# EAGLE schematic GDPHS_VGA - v2.2.1 (EAGLE 7.3.0)

## Sheet 1 of 4
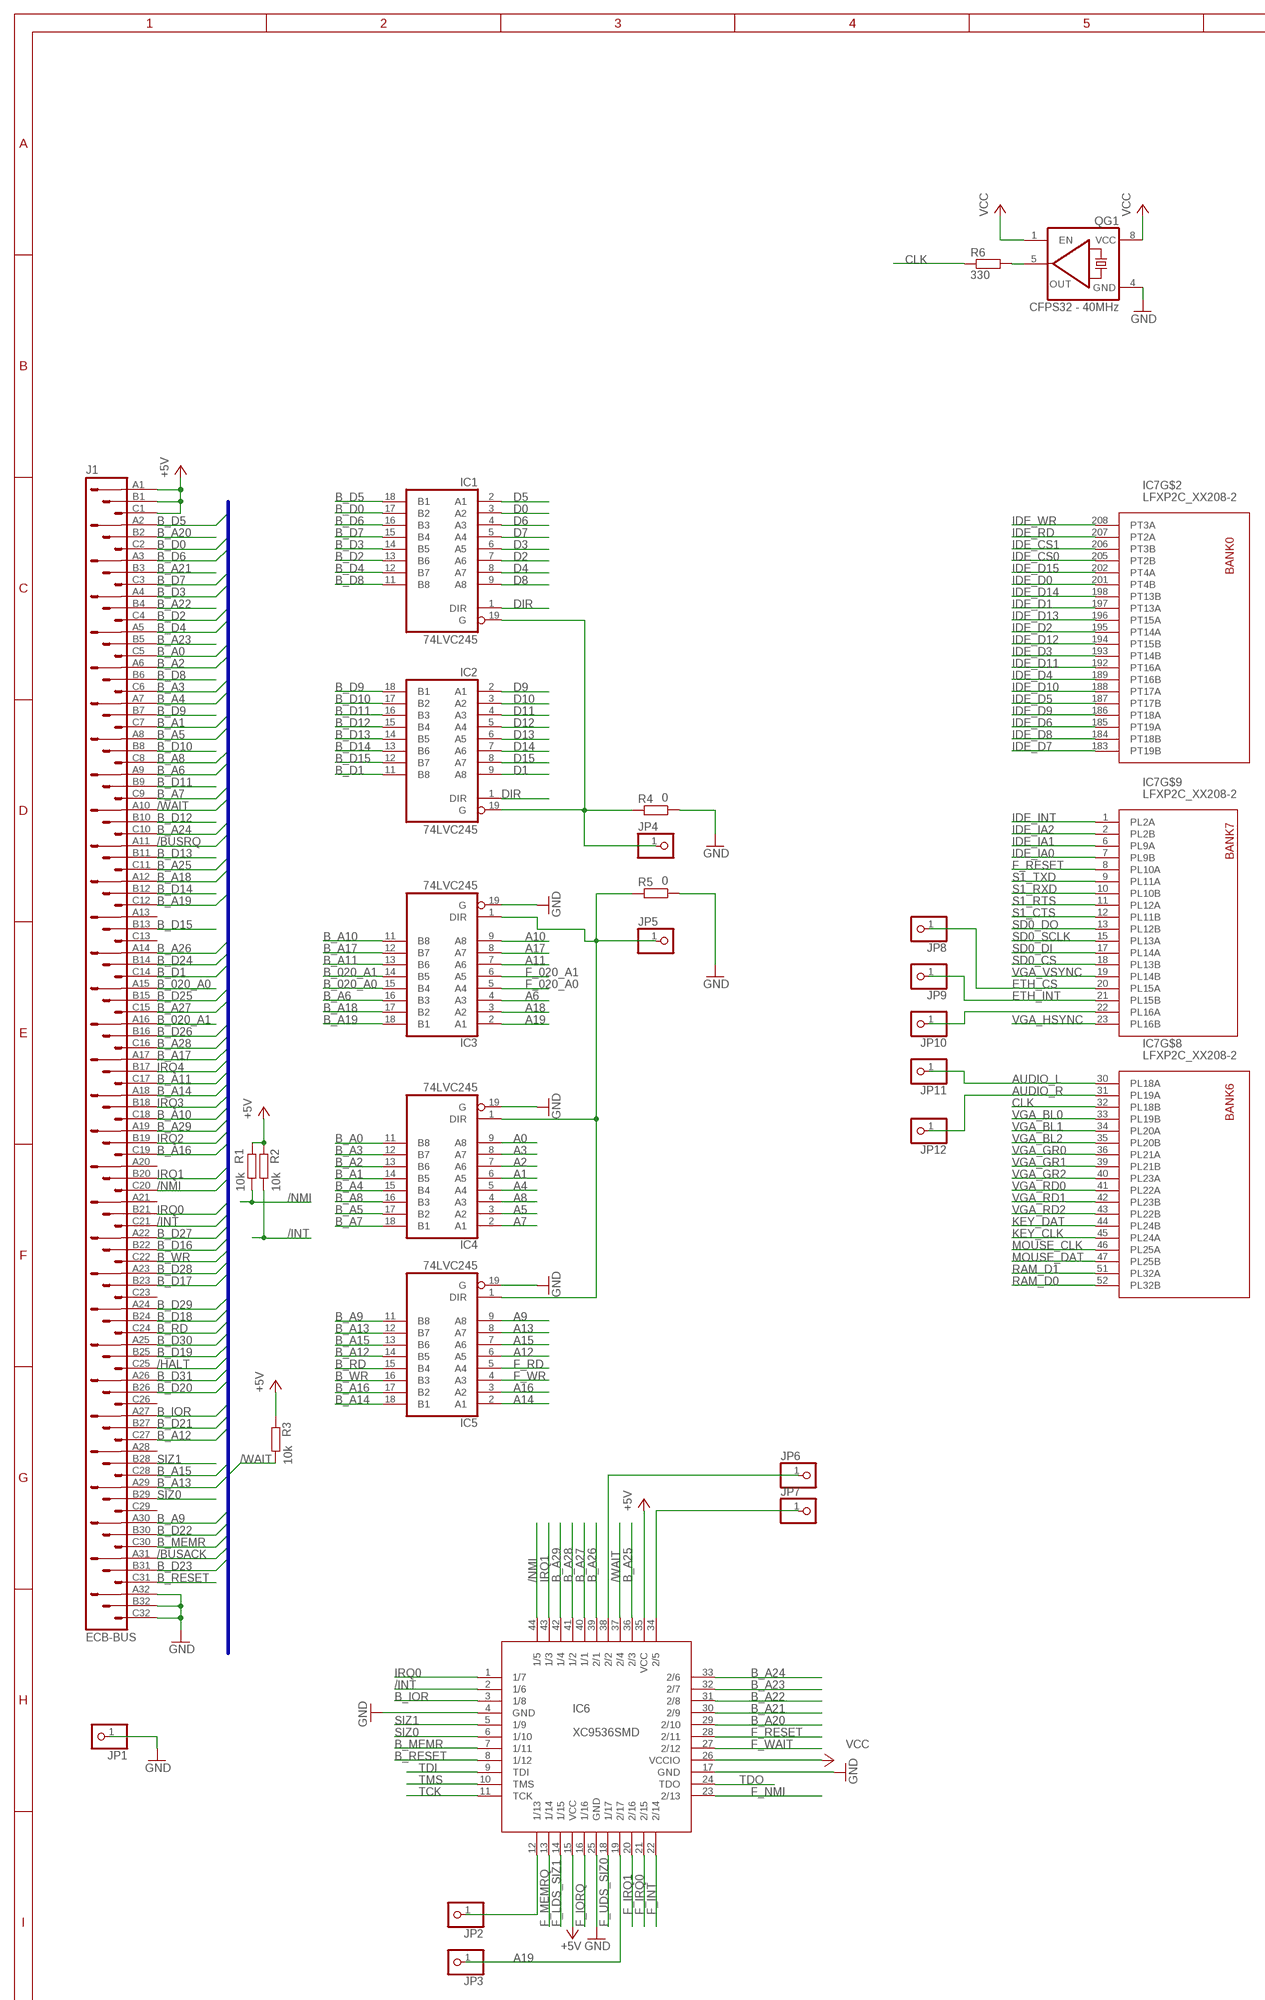
[diagram p0: schematic, sheet 1, part 1 of 2]
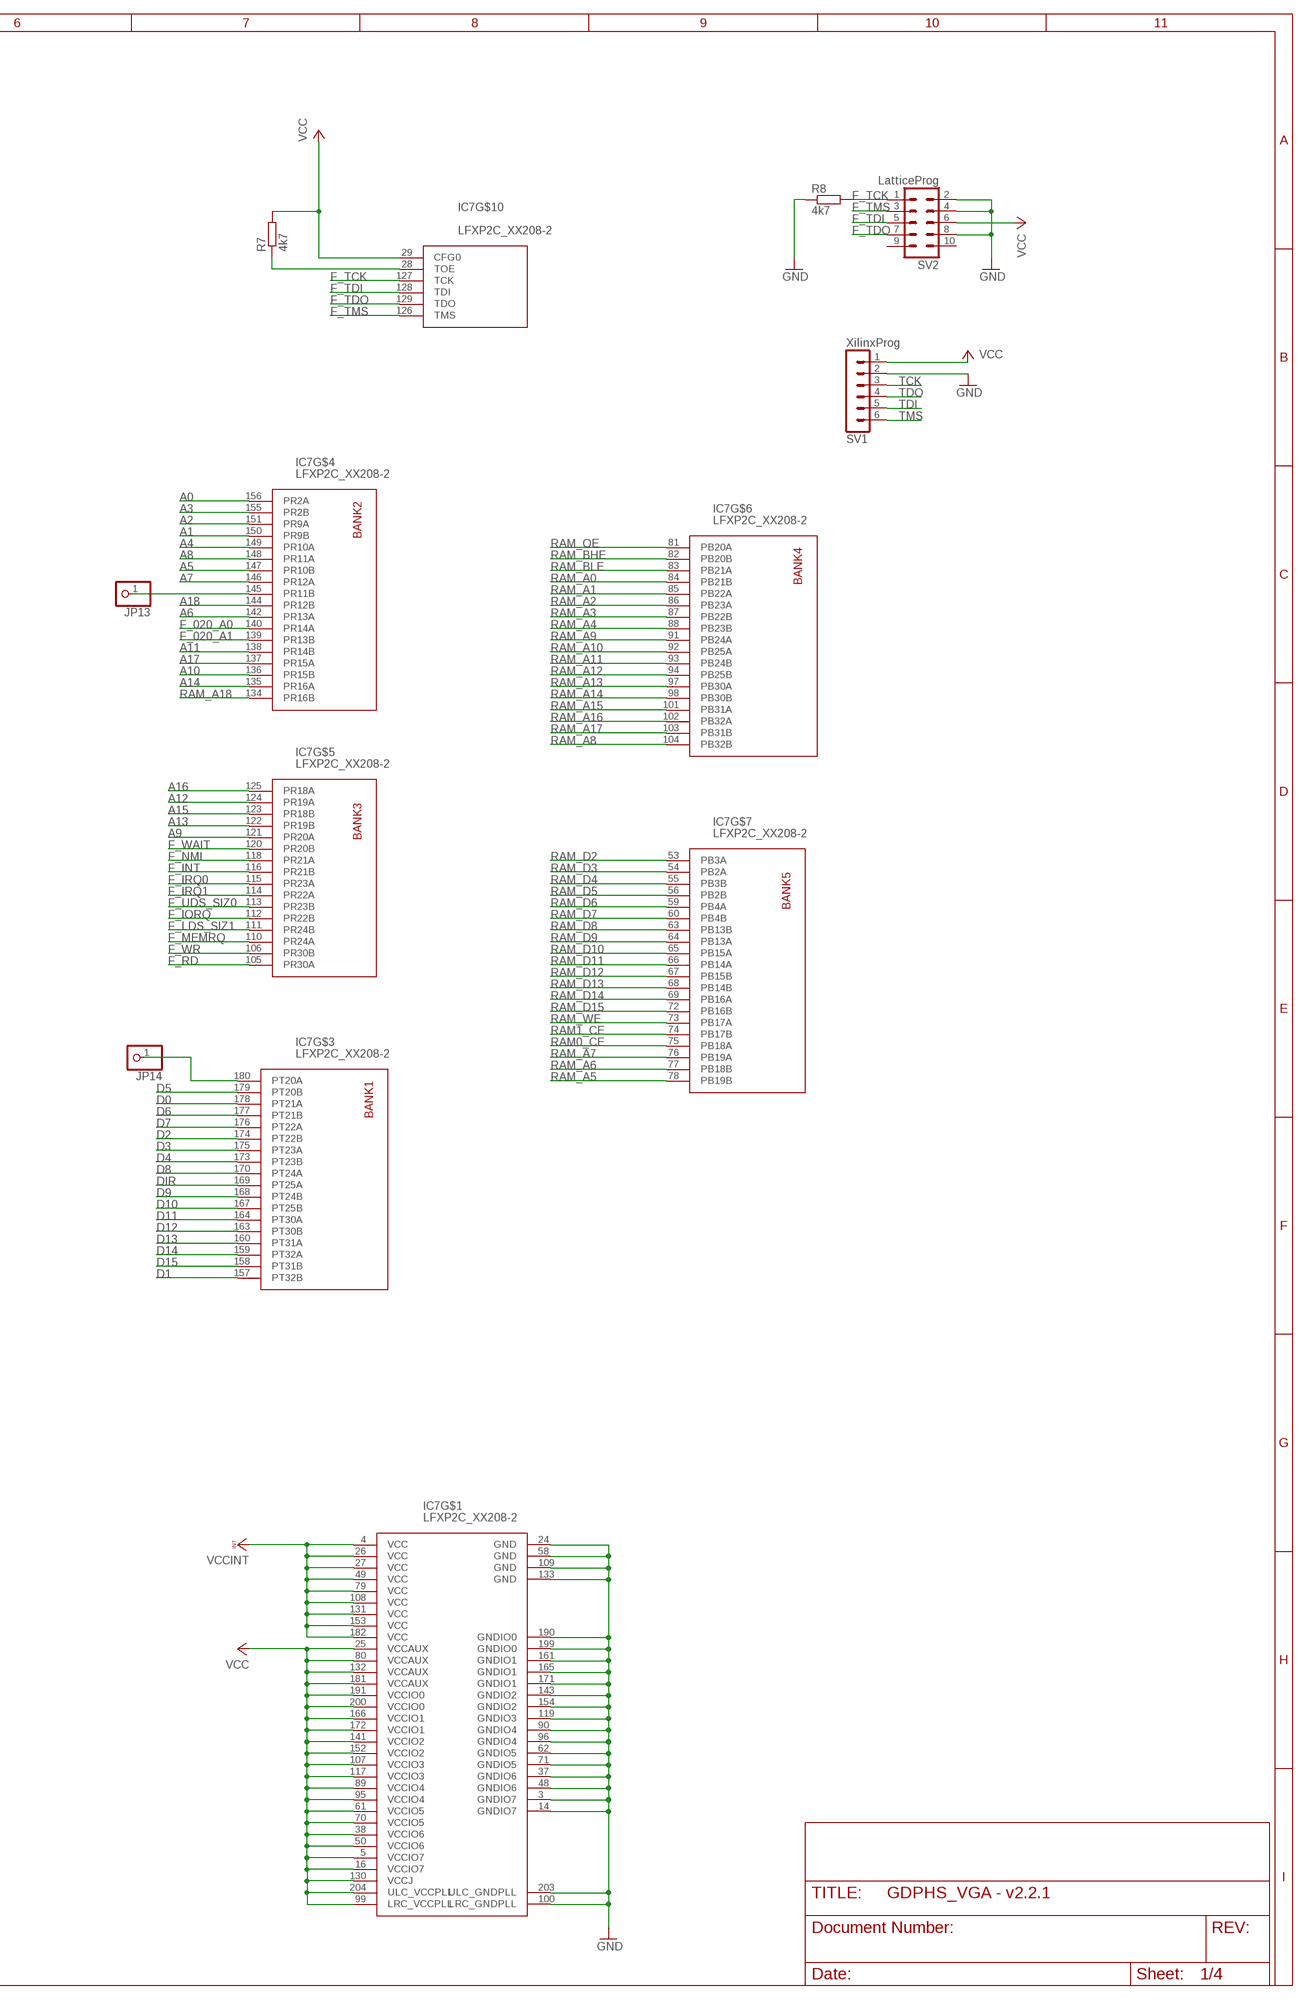
[diagram p1: schematic, sheet 1, part 2 of 2]

### Parts
IC1  74LVC245  74LVC245DW  [SO20W]
IC2  74LVC245  74LVC245DW  [SO20W]
IC3  74LVC245  74LVC245DW  [SO20W]
IC4  74LVC245  74LVC245DW  [SO20W]
IC5  74LVC245  74LVC245DW  [SO20W]
IC6  XC9536SMD  [TQFP44]
IC7  LFXP2C_XX208-2  [PQFP_208]
J1  ECB-BUS  VG96K  [VG96K]
JP1  PINHD-1X1  [1X01]
JP2  PINHD-1X1  [1X01]
JP3  PINHD-1X1  [1X01]
JP4  PINHD-1X1  [1X01]
JP5  PINHD-1X1  [1X01]
JP6  PINHD-1X1  [1X01]
JP7  PINHD-1X1  [1X01]
JP8  PINHD-1X1  [1X01]
JP9  PINHD-1X1  [1X01]
JP10  PINHD-1X1  [1X01]
JP11  PINHD-1X1  [1X01]
JP12  PINHD-1X1  [1X01]
JP13  PINHD-1X1  [1X01]
JP14  PINHD-1X1  [1X01]
QG1  CFPS32 - 40MHz  CRYSTAL_RESONATORCFPS7X  [CFPS7X]
R1  10k  R-EU_M0805  [M0805]
R2  10k  R-EU_M0805  [M0805]
R3  10k  R-EU_M0805  [M0805]
R4  0  R-EU_M0805  [M0805]
R5  0  R-EU_M0805  [M0805]
R6  330  R-EU_M0805  [M0805]
R7  4k7  R-EU_M0805  [M0805]
R8  4k7  R-EU_M0805  [M0805]
SV1  XilinxProg  MA06-1  [MA06-1]
SV2  LatticeProg  MA05-2  [MA05-2]

### Nets
$34: IC6.38(2/2) JP6.1
+5V: IC6.15(VCC) IC6.35(VCC) J1.A1 J1.B1 J1.C1 R1.2 R2.2 R3.2 ; also sheet 2,3
/BUSACK: J1.A31
/BUSRQ: J1.A11
/HALT: J1.C25
/INT: IC6.2(1/6) J1.C21 R2.1
/NMI: IC6.44(1/5) J1.C20 R1.1
/WAIT: IC6.37(2/4) J1.A10 R3.1
A0: IC4.9(A8) IC7.156(PR2A)
A1: IC4.6(A5) IC7.150(PR9B)
A2: IC4.7(A6) IC7.151(PR9A)
A3: IC4.8(A7) IC7.155(PR2B)
A4: IC4.5(A4) IC7.149(PR10A)
A5: IC4.3(A2) IC7.147(PR10B)
A6: IC3.4(A3) IC7.142(PR13A)
A7: IC4.2(A1) IC7.146(PR12A)
A8: IC4.4(A3) IC7.148(PR11A)
A9: IC5.9(A8) IC7.121(PR20A)
A10: IC3.9(A8) IC7.136(PR15B)
A11: IC3.7(A6) IC7.138(PR14B)
A12: IC5.6(A5) IC7.124(PR19A)
A13: IC5.8(A7) IC7.122(PR19B)
A14: IC5.2(A1) IC7.135(PR16A)
A15: IC5.7(A6) IC7.123(PR18B)
A16: IC5.3(A2) IC7.125(PR18A)
A17: IC3.8(A7) IC7.137(PR15A)
A18: IC3.3(A2) IC7.144(PR12B)
A19: IC3.2(A1) IC6.19(2/17) JP3.1
AUDIO_L: IC7.30(PL18A) JP11.1 ; also sheet 3
AUDIO_R: IC7.31(PL19A) JP12.1 ; also sheet 3
B_020_A0: IC3.15(B4) J1.A15
B_020_A1: IC3.14(B5) J1.A16
B_A0: IC4.11(B8) J1.C5
B_A1: IC4.14(B5) J1.C7
B_A2: IC4.13(B6) J1.A6
B_A3: IC4.12(B7) J1.C6
B_A4: IC4.15(B4) J1.A7
B_A5: IC4.17(B2) J1.A8
B_A6: IC3.16(B3) J1.A9
B_A7: IC4.18(B1) J1.C9
B_A8: IC4.16(B3) J1.C8
B_A9: IC5.11(B8) J1.A30
B_A10: IC3.11(B8) J1.C18
B_A11: IC3.13(B6) J1.C17
B_A12: IC5.14(B5) J1.C27
B_A13: IC5.12(B7) J1.A29
B_A14: IC5.18(B1) J1.A18
B_A15: IC5.13(B6) J1.C28
B_A16: IC5.17(B2) J1.C19
B_A17: IC3.12(B7) J1.A17
B_A18: IC3.17(B2) J1.A12
B_A19: IC3.18(B1) J1.C12
B_A20: IC6.29(2/10) J1.B2
B_A21: IC6.30(2/9) J1.B3
B_A22: IC6.31(2/8) J1.B4
B_A23: IC6.32(2/7) J1.B5
B_A24: IC6.33(2/6) J1.C10
B_A25: IC6.36(2/3) J1.C11
B_A26: IC6.39(2/1) J1.A14
B_A27: IC6.40(1/1) J1.C15
B_A28: IC6.41(1/2) J1.C16
B_A29: IC6.42(1/4) J1.A19
B_D0: IC1.17(B2) J1.C2
B_D1: IC2.11(B8) J1.C14
B_D2: IC1.13(B6) J1.C4
B_D3: IC1.14(B5) J1.A4
B_D4: IC1.12(B7) J1.A5
B_D5: IC1.18(B1) J1.A2
B_D6: IC1.16(B3) J1.A3
B_D7: IC1.15(B4) J1.C3
B_D8: IC1.11(B8) J1.B6
B_D9: IC2.18(B1) J1.B7
B_D10: IC2.17(B2) J1.B8
B_D11: IC2.16(B3) J1.B9
B_D12: IC2.15(B4) J1.B10
B_D13: IC2.14(B5) J1.B11
B_D14: IC2.13(B6) J1.B12
B_D15: IC2.12(B7) J1.B13
B_D16: J1.B22
B_D17: J1.B23
B_D18: J1.B24
B_D19: J1.B25
B_D20: J1.B26
B_D21: J1.B27
B_D22: J1.B30
B_D23: J1.B31
B_D24: J1.B14
B_D25: J1.B15
B_D26: J1.B16
B_D27: J1.A22
B_D28: J1.A23
B_D29: J1.A24
B_D30: J1.A25
B_D31: J1.A26
B_IOR: IC6.3(1/8) J1.A27
B_MEMR: IC6.7(1/11) J1.C30
B_RD: IC5.15(B4) J1.C24
B_RESET: IC6.8(1/12) J1.C31
B_WR: IC5.16(B3) J1.C22
CLK: IC7.32(PL18B) R6.1
D0: IC1.3(A2) IC7.178(PT21A)
D1: IC2.9(A8) IC7.157(PT32B)
D2: IC1.7(A6) IC7.174(PT22B)
D3: IC1.6(A5) IC7.175(PT23A)
D4: IC1.8(A7) IC7.173(PT23B)
D5: IC1.2(A1) IC7.179(PT20B)
D6: IC1.4(A3) IC7.177(PT21B)
D7: IC1.5(A4) IC7.176(PT22A)
D8: IC1.9(A8) IC7.170(PT24A)
D9: IC2.2(A1) IC7.168(PT24B)
D10: IC2.3(A2) IC7.167(PT25B)
D11: IC2.4(A3) IC7.164(PT30A)
D12: IC2.5(A4) IC7.163(PT30B)
D13: IC2.6(A5) IC7.160(PT31A)
D14: IC2.7(A6) IC7.159(PT32A)
D15: IC2.8(A7) IC7.158(PT31B)
DIR: IC1.1(DIR) IC2.1(DIR) IC7.169(PT25A)
ETH_CS: IC7.20(PL15A) JP8.1 ; also sheet 4
ETH_INT: IC7.21(PL15B) JP9.1 ; also sheet 4
F_020_A0: IC3.5(A4) IC7.140(PR14A)
F_020_A1: IC3.6(A5) IC7.139(PR13B)
F_INT: IC6.22(2/14) IC7.116(PR21B)
F_IORQ: IC6.16(1/16) IC7.112(PR22B)
F_IRQ0: IC6.21(2/15) IC7.115(PR23A)
F_IRQ1: IC6.20(2/16) IC7.114(PR22A)
F_LDS_SIZ1: IC6.14(1/15) IC7.111(PR24B)
F_MEMRQ: IC6.13(1/14) IC7.110(PR24A)
F_NMI: IC6.23(2/13) IC7.118(PR21A)
F_RD: IC5.5(A4) IC7.105(PR30A)
F_RESET: IC6.28(2/11) IC7.8(PL10A) ; also sheet 3,4
F_TCK: IC7.127(TCK) R8.2 SV2.1
F_TDI: IC7.128(TDI) SV2.5
F_TDO: IC7.129(TDO) SV2.7
F_TMS: IC7.126(TMS) SV2.3
F_UDS_SIZ0: IC6.18(1/17) IC7.113(PR23B)
F_WAIT: IC6.27(2/12) IC7.120(PR20B)
F_WR: IC5.4(A3) IC7.106(PR30B)
GND: IC3.19(G) IC4.19(G) IC5.19(G) IC6.4(GND) IC6.17(GND) IC6.25(GND) IC7.3(GNDIO7) IC7.14(GNDIO7) IC7.24(GND) IC7.37(GNDIO6) IC7.48(GNDIO6) IC7.58(GND) IC7.62(GNDIO5) IC7.71(GNDIO5) IC7.90(GNDIO4) IC7.96(GNDIO4) IC7.100(LRC_GNDPLL) IC7.109(GND) IC7.119(GNDIO3) IC7.133(GND) IC7.143(GNDIO2) IC7.154(GNDIO2) IC7.161(GNDIO1) IC7.165(GNDIO1) IC7.171(GNDIO1) IC7.190(GNDIO0) IC7.199(GNDIO0) IC7.203(ULC_GNDPLL) J1.A32 J1.B32 J1.C32 JP1.1 QG1.4(GND) R4.1 R5.1 R8.1 SV1.2 SV2.2 SV2.4 SV2.8 ; also sheet 2,3,4
IDE_CS0: IC7.205(PT2B) ; also sheet 3
IDE_CS1: IC7.206(PT3B) ; also sheet 3
IDE_D0: IC7.201(PT4B) ; also sheet 3
IDE_D1: IC7.197(PT13A) ; also sheet 3
IDE_D2: IC7.195(PT14A) ; also sheet 3
IDE_D3: IC7.193(PT14B) ; also sheet 3
IDE_D4: IC7.189(PT16B) ; also sheet 3
IDE_D5: IC7.187(PT17B) ; also sheet 3
IDE_D6: IC7.185(PT19A) ; also sheet 3
IDE_D7: IC7.183(PT19B) ; also sheet 3
IDE_D8: IC7.184(PT18B) ; also sheet 3
IDE_D9: IC7.186(PT18A) ; also sheet 3
IDE_D10: IC7.188(PT17A) ; also sheet 3
IDE_D11: IC7.192(PT16A) ; also sheet 3
IDE_D12: IC7.194(PT15B) ; also sheet 3
IDE_D13: IC7.196(PT15A) ; also sheet 3
IDE_D14: IC7.198(PT13B) ; also sheet 3
IDE_D15: IC7.202(PT4A) ; also sheet 3
IDE_IA0: IC7.7(PL9B) ; also sheet 3
IDE_IA1: IC7.6(PL9A) ; also sheet 3
IDE_IA2: IC7.2(PL2B) ; also sheet 3
IDE_INT: IC7.1(PL2A) ; also sheet 3
IDE_RD: IC7.207(PT2A) ; also sheet 3
IDE_WR: IC7.208(PT3A) ; also sheet 3
IRQ0: IC6.1(1/7) J1.B21
IRQ1: IC6.43(1/3) J1.B20
IRQ2: J1.B19
IRQ3: J1.B18
IRQ4: J1.B17
KEY_CLK: IC7.45(PL24A) ; also sheet 3
KEY_DAT: IC7.44(PL24B) ; also sheet 3
MOUSE_CLK: IC7.46(PL25A) ; also sheet 3
MOUSE_DAT: IC7.47(PL25B) ; also sheet 3
N$5: QG1.5(OUT) R6.2
N$25: IC7.22(PL16A) JP10.1
N$26: IC7.28(TOE) R7.1
N$31: IC7.145(PR11B) JP13.1
N$32: IC6.34(2/5) JP7.1
N$33: IC6.12(1/13) JP2.1
N$41: IC3.1(DIR) IC4.1(DIR) IC5.1(DIR) JP5.1 R5.2
N$42: IC1.19(G) IC2.19(G) JP4.1 R4.2
N$49: IC7.180(PT20A) JP14.1
RAM0_CE: IC7.75(PB18A) ; also sheet 2
RAM1_CE: IC7.74(PB17B) ; also sheet 2
RAM_A0: IC7.84(PB21B) ; also sheet 2
RAM_A1: IC7.85(PB22A) ; also sheet 2
RAM_A2: IC7.86(PB23A) ; also sheet 2
RAM_A3: IC7.87(PB22B) ; also sheet 2
RAM_A4: IC7.88(PB23B) ; also sheet 2
RAM_A5: IC7.78(PB19B) ; also sheet 2
RAM_A6: IC7.77(PB18B) ; also sheet 2
RAM_A7: IC7.76(PB19A) ; also sheet 2
RAM_A8: IC7.104(PB32B) ; also sheet 2
RAM_A9: IC7.91(PB24A) ; also sheet 2
RAM_A10: IC7.92(PB25A) ; also sheet 2
RAM_A11: IC7.93(PB24B) ; also sheet 2
RAM_A12: IC7.94(PB25B) ; also sheet 2
RAM_A13: IC7.97(PB30A) ; also sheet 2
RAM_A14: IC7.98(PB30B) ; also sheet 2
RAM_A15: IC7.101(PB31A) ; also sheet 2
RAM_A16: IC7.102(PB32A) ; also sheet 2
RAM_A17: IC7.103(PB31B) ; also sheet 2
RAM_A18: IC7.134(PR16B) ; also sheet 2
RAM_BHE: IC7.82(PB20B) ; also sheet 2
RAM_BLE: IC7.83(PB21A) ; also sheet 2
RAM_D0: IC7.52(PL32B) ; also sheet 2
RAM_D1: IC7.51(PL32A) ; also sheet 2
RAM_D2: IC7.53(PB3A) ; also sheet 2
RAM_D3: IC7.54(PB2A) ; also sheet 2
RAM_D4: IC7.55(PB3B) ; also sheet 2
RAM_D5: IC7.56(PB2B) ; also sheet 2
RAM_D6: IC7.59(PB4A) ; also sheet 2
RAM_D7: IC7.60(PB4B) ; also sheet 2
RAM_D8: IC7.63(PB13B) ; also sheet 2
RAM_D9: IC7.64(PB13A) ; also sheet 2
RAM_D10: IC7.65(PB15A) ; also sheet 2
RAM_D11: IC7.66(PB14A) ; also sheet 2
RAM_D12: IC7.67(PB15B) ; also sheet 2
RAM_D13: IC7.68(PB14B) ; also sheet 2
RAM_D14: IC7.69(PB16A) ; also sheet 2
RAM_D15: IC7.72(PB16B) ; also sheet 2
RAM_OE: IC7.81(PB20A) ; also sheet 2
RAM_WE: IC7.73(PB17A) ; also sheet 2
S1_CTS: IC7.12(PL11B) ; also sheet 3
S1_RTS: IC7.11(PL12A) ; also sheet 3
S1_RXD: IC7.10(PL10B) ; also sheet 3
S1_TXD: IC7.9(PL11A) ; also sheet 3
SD0_CS: IC7.18(PL13B) ; also sheet 3
SD0_DI: IC7.17(PL14A) ; also sheet 3,4
SD0_DO: IC7.13(PL12B) ; also sheet 3,4
SD0_SCLK: IC7.15(PL13A) ; also sheet 3,4
SIZ0: IC6.6(1/10) J1.B29
SIZ1: IC6.5(1/9) J1.B28
TCK: IC6.11(TCK) SV1.3
TDI: IC6.9(TDI) SV1.5
TDO: IC6.24(TDO) SV1.4
TMS: IC6.10(TMS) SV1.6
VCC: IC6.26(VCCIO) IC7.5(VCCIO7) IC7.16(VCCIO7) IC7.25(VCCAUX) IC7.29(CFG0) IC7.38(VCCIO6) IC7.50(VCCIO6) IC7.61(VCCIO5) IC7.70(VCCIO5) IC7.80(VCCAUX) IC7.89(VCCIO4) IC7.95(VCCIO4) IC7.99(LRC_VCCPLL) IC7.107(VCCIO3) IC7.117(VCCIO3) IC7.130(VCCJ) IC7.132(VCCAUX) IC7.141(VCCIO2) IC7.152(VCCIO2) IC7.166(VCCIO1) IC7.172(VCCIO1) IC7.181(VCCAUX) IC7.191(VCCIO0) IC7.200(VCCIO0) IC7.204(ULC_VCCPLL) QG1.1(EN) QG1.8(VCC) R7.2 SV1.1 SV2.6 ; also sheet 2,3,4
VCCINT: IC7.4(VCC) IC7.26(VCC) IC7.27(VCC) IC7.49(VCC) IC7.79(VCC) IC7.108(VCC) IC7.131(VCC) IC7.153(VCC) IC7.182(VCC) ; also sheet 2
VGA_BL0: IC7.33(PL19B) ; also sheet 3
VGA_BL1: IC7.34(PL20A) ; also sheet 3
VGA_BL2: IC7.35(PL20B) ; also sheet 3
VGA_GR0: IC7.36(PL21A) ; also sheet 3
VGA_GR1: IC7.39(PL21B) ; also sheet 3
VGA_GR2: IC7.40(PL23A) ; also sheet 3
VGA_HSYNC: IC7.23(PL16B) ; also sheet 3
VGA_RD0: IC7.41(PL22A) ; also sheet 3
VGA_RD1: IC7.42(PL23B) ; also sheet 3
VGA_RD2: IC7.43(PL22B) ; also sheet 3
VGA_VSYNC: IC7.19(PL14B) ; also sheet 3
Unconnected: J1.A13 J1.A20 J1.A21 J1.A28 J1.C13 J1.C23 J1.C26 J1.C29 SV2.9 SV2.10

### Buses
B_D[0..31],B_A[0..31],IRQ[0..7],B_BANK,B_HALT,B_RD,B_WR,B_IOR,B_MEMR,B_M1,B_RFSH,B_BACK,/INT,/NMI,/RESET,/WAIT,/BUSRQ,CLK,/BUSACK,/HALT

## Sheet 2 of 4
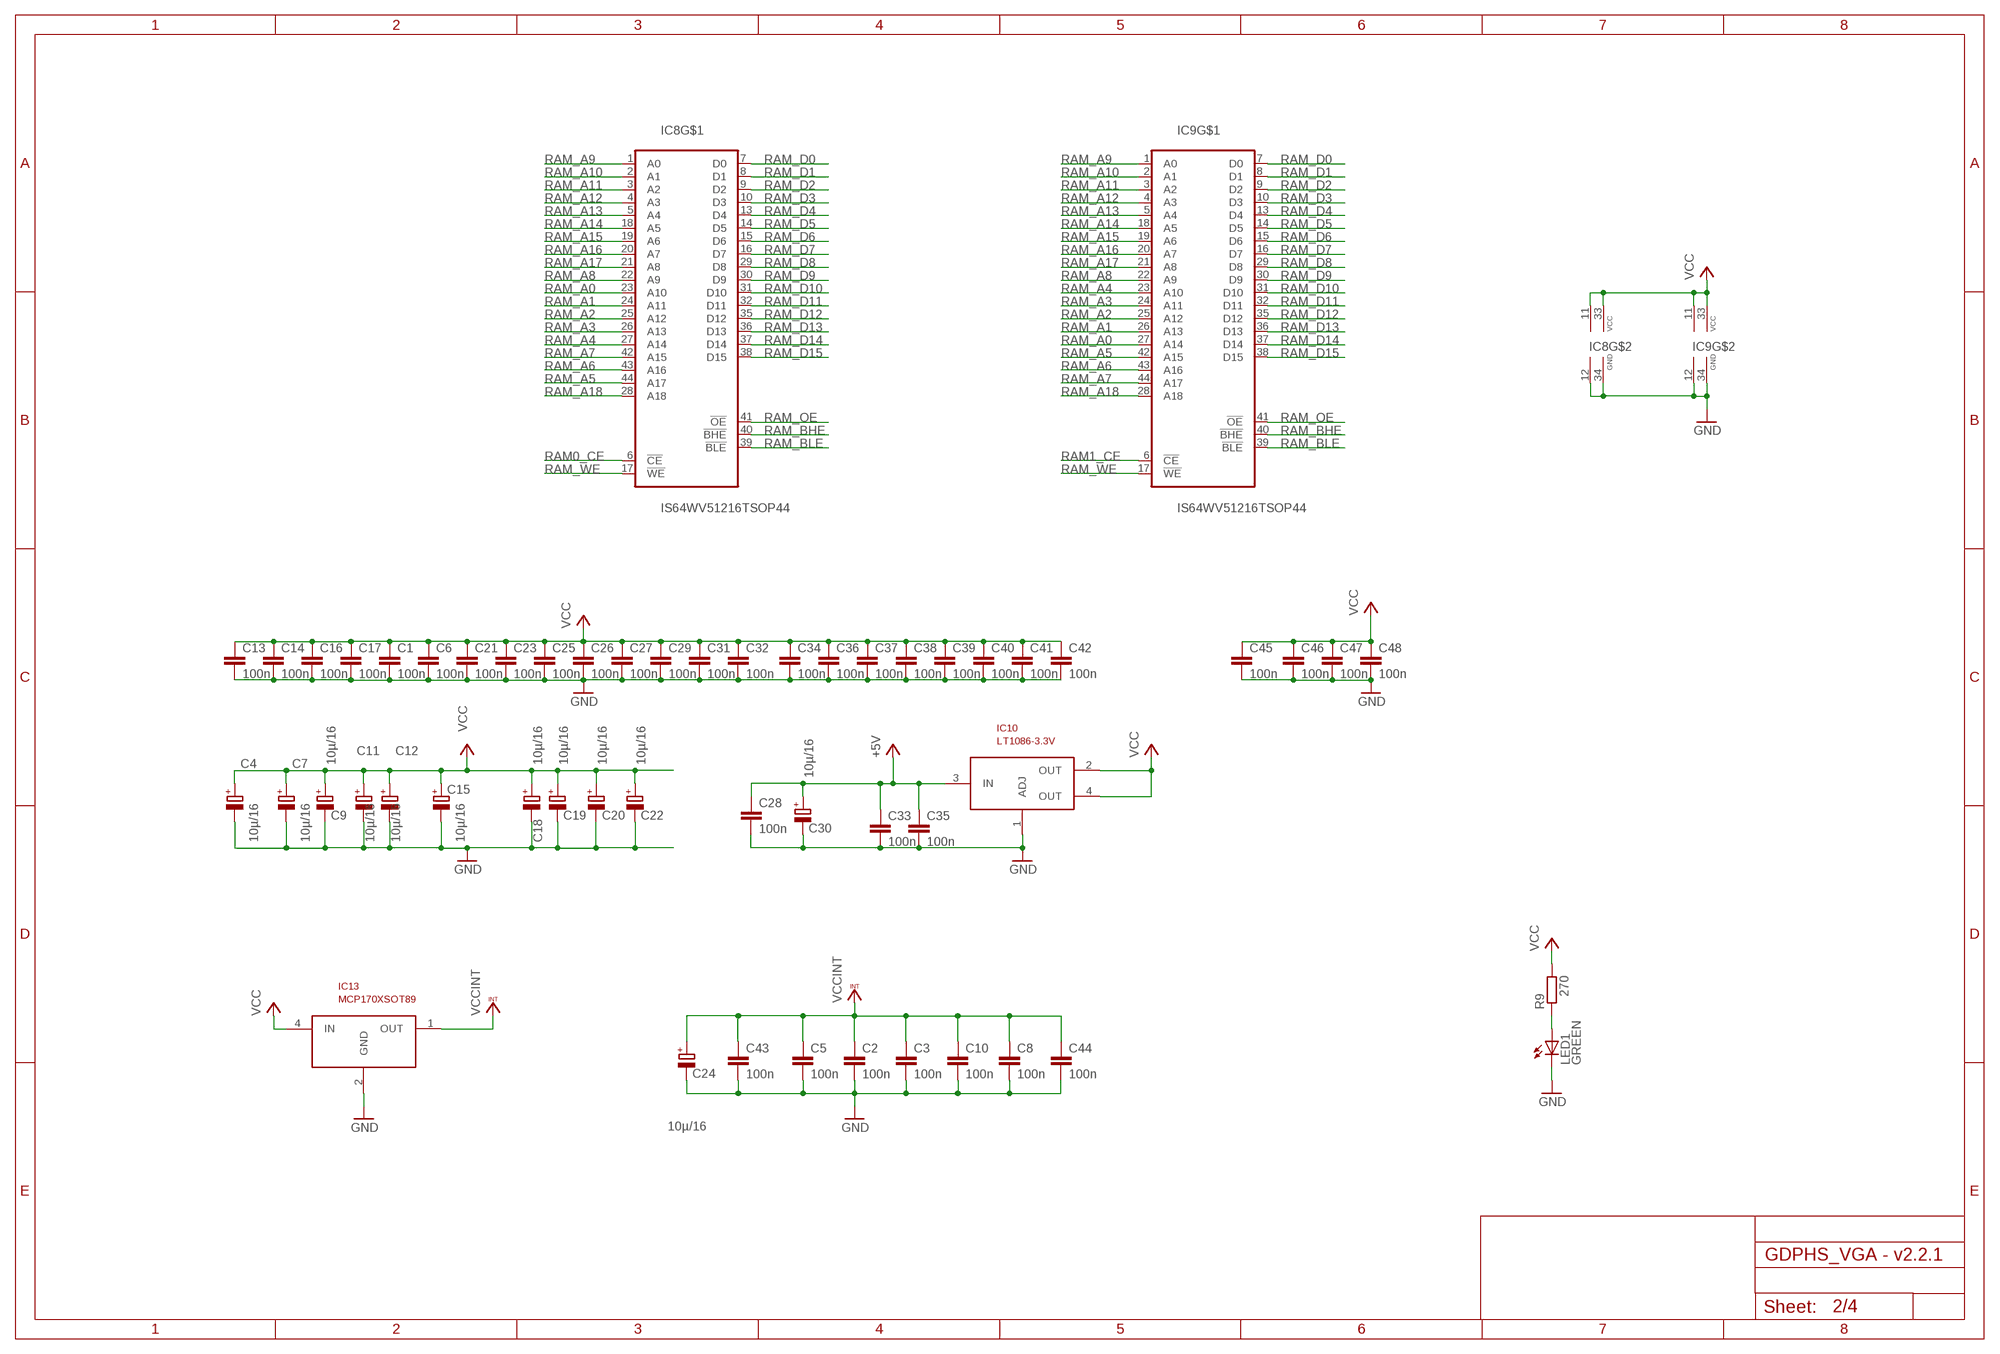
[diagram p2: schematic, sheet 2]

### Parts
C1  100n  C-EUC0805  [C0805]
C2  100n  C-EUC0805  [C0805]
C3  100n  C-EUC0805  [C0805]
C4  10µ/16  CPOL-EUSMCC  [SMC_C]
C5  100n  C-EUC0805  [C0805]
C6  100n  C-EUC0805  [C0805]
C7  10µ/16  CPOL-EUSMCC  [SMC_C]
C8  100n  C-EUC0805  [C0805]
C9  10µ/16  CPOL-EUSMCC  [SMC_C]
C10  100n  C-EUC0805  [C0805]
C11  10µ/16  CPOL-EUSMCC  [SMC_C]
C12  10µ/16  CPOL-EUSMCC  [SMC_C]
C13  100n  C-EUC0805  [C0805]
C14  100n  C-EUC0805  [C0805]
C15  10µ/16  CPOL-EUSMCC  [SMC_C]
C16  100n  C-EUC0805  [C0805]
C17  100n  C-EUC0805  [C0805]
C18  10µ/16  CPOL-EUSMCC  [SMC_C]
C19  10µ/16  CPOL-EUSMCC  [SMC_C]
C20  10µ/16  CPOL-EUSMCC  [SMC_C]
C21  100n  C-EUC0805  [C0805]
C22  10µ/16  CPOL-EUSMCC  [SMC_C]
C23  100n  C-EUC0805  [C0805]
C24  10µ/16  CPOL-EUSMCC  [SMC_C]
C25  100n  C-EUC0805  [C0805]
C26  100n  C-EUC0805  [C0805]
C27  100n  C-EUC0805  [C0805]
C28  100n  C-EUC0805  [C0805]
C29  100n  C-EUC0805  [C0805]
C30  10µ/16  CPOL-EUSMCC  [SMC_C]
C31  100n  C-EUC0805  [C0805]
C32  100n  C-EUC0805  [C0805]
C33  100n  C-EUC0805  [C0805]
C34  100n  C-EUC0805  [C0805]
C35  100n  C-EUC0805  [C0805]
C36  100n  C-EUC0805  [C0805]
C37  100n  C-EUC0805  [C0805]
C38  100n  C-EUC0805  [C0805]
C39  100n  C-EUC0805  [C0805]
C40  100n  C-EUC0805  [C0805]
C41  100n  C-EUC0805  [C0805]
C42  100n  C-EUC0805  [C0805]
C43  100n  C-EUC0805  [C0805]
C44  100n  C-EUC0805  [C0805]
C45  100n  C-EUC0805  [C0805]
C46  100n  C-EUC0805  [C0805]
C47  100n  C-EUC0805  [C0805]
C48  100n  C-EUC0805  [C0805]
IC8  IS64WV51216TSOP44  [TSOP44-400]
IC9  IS64WV51216TSOP44  [TSOP44-400]
IC10  LT1086-3.3V  LT1086  [MDD]
IC13  MCP170XSOT89  [SOT89-W]
LED1  GREEN  LEDCHIPLED_0805  [CHIPLED_0805]
R9  270  R-EU_M0805  [M0805]

### Nets
+5V: C28.1 C30.+ C33.1 C35.1 IC10.3(IN) ; also sheet 1,3
GND: C1.2 C2.2 C3.2 C4.- C5.2 C6.2 C7.- C8.2 C9.- C10.2 C11.- C12.- C13.2 C14.2 C15.- C16.2 C17.2 C18.- C19.- C20.- C21.2 C22.- C23.2 C24.- C25.2 C26.2 C27.2 C28.2 C29.2 C30.- C31.2 C32.2 C33.2 C34.2 C35.2 C36.2 C37.2 C38.2 C39.2 C40.2 C41.2 C42.2 C43.2 C44.2 C45.2 C46.2 C47.2 C48.2 IC8.12(GND) IC8.34(GND) IC9.12(GND) IC9.34(GND) IC10.1(ADJ) IC13.2(GND) LED1.C ; also sheet 1,3,4
N$15: LED1.A R9.1
RAM0_CE: IC8.6(!CE) ; also sheet 1
RAM1_CE: IC9.6(!CE) ; also sheet 1
RAM_A0: IC8.23(A10) IC9.27(A14) ; also sheet 1
RAM_A1: IC8.24(A11) IC9.26(A13) ; also sheet 1
RAM_A2: IC8.25(A12) IC9.25(A12) ; also sheet 1
RAM_A3: IC8.26(A13) IC9.24(A11) ; also sheet 1
RAM_A4: IC8.27(A14) IC9.23(A10) ; also sheet 1
RAM_A5: IC8.44(A17) IC9.42(A15) ; also sheet 1
RAM_A6: IC8.43(A16) IC9.43(A16) ; also sheet 1
RAM_A7: IC8.42(A15) IC9.44(A17) ; also sheet 1
RAM_A8: IC8.22(A9) IC9.22(A9) ; also sheet 1
RAM_A9: IC8.1(A0) IC9.1(A0) ; also sheet 1
RAM_A10: IC8.2(A1) IC9.2(A1) ; also sheet 1
RAM_A11: IC8.3(A2) IC9.3(A2) ; also sheet 1
RAM_A12: IC8.4(A3) IC9.4(A3) ; also sheet 1
RAM_A13: IC8.5(A4) IC9.5(A4) ; also sheet 1
RAM_A14: IC8.18(A5) IC9.18(A5) ; also sheet 1
RAM_A15: IC8.19(A6) IC9.19(A6) ; also sheet 1
RAM_A16: IC8.20(A7) IC9.20(A7) ; also sheet 1
RAM_A17: IC8.21(A8) IC9.21(A8) ; also sheet 1
RAM_A18: IC8.28(A18) IC9.28(A18) ; also sheet 1
RAM_BHE: IC8.40(!BHE) IC9.40(!BHE) ; also sheet 1
RAM_BLE: IC8.39(!BLE) IC9.39(!BLE) ; also sheet 1
RAM_D0: IC8.7(D0) IC9.7(D0) ; also sheet 1
RAM_D1: IC8.8(D1) IC9.8(D1) ; also sheet 1
RAM_D2: IC8.9(D2) IC9.9(D2) ; also sheet 1
RAM_D3: IC8.10(D3) IC9.10(D3) ; also sheet 1
RAM_D4: IC8.13(D4) IC9.13(D4) ; also sheet 1
RAM_D5: IC8.14(D5) IC9.14(D5) ; also sheet 1
RAM_D6: IC8.15(D6) IC9.15(D6) ; also sheet 1
RAM_D7: IC8.16(D7) IC9.16(D7) ; also sheet 1
RAM_D8: IC8.29(D8) IC9.29(D8) ; also sheet 1
RAM_D9: IC8.30(D9) IC9.30(D9) ; also sheet 1
RAM_D10: IC8.31(D10) IC9.31(D10) ; also sheet 1
RAM_D11: IC8.32(D11) IC9.32(D11) ; also sheet 1
RAM_D12: IC8.35(D12) IC9.35(D12) ; also sheet 1
RAM_D13: IC8.36(D13) IC9.36(D13) ; also sheet 1
RAM_D14: IC8.37(D14) IC9.37(D14) ; also sheet 1
RAM_D15: IC8.38(D15) IC9.38(D15) ; also sheet 1
RAM_OE: IC8.41(!OE) IC9.41(!OE) ; also sheet 1
RAM_WE: IC8.17(!WE) IC9.17(!WE) ; also sheet 1
VCC: C1.1 C4.+ C6.1 C7.+ C9.+ C11.+ C12.+ C13.1 C14.1 C15.+ C16.1 C17.1 C18.+ C19.+ C20.+ C21.1 C22.+ C23.1 C25.1 C26.1 C27.1 C29.1 C31.1 C32.1 C34.1 C36.1 C37.1 C38.1 C39.1 C40.1 C41.1 C42.1 C45.1 C46.1 C47.1 C48.1 IC8.11(VCC) IC8.33(VCC2) IC9.11(VCC) IC9.33(VCC2) IC10.2(OUT) IC10.4(OUT) IC13.4(IN) R9.2 ; also sheet 1,3,4
VCCINT: C2.1 C3.1 C5.1 C8.1 C10.1 C24.+ C43.1 C44.1 IC13.1(OUT) ; also sheet 1

## Sheet 3 of 4
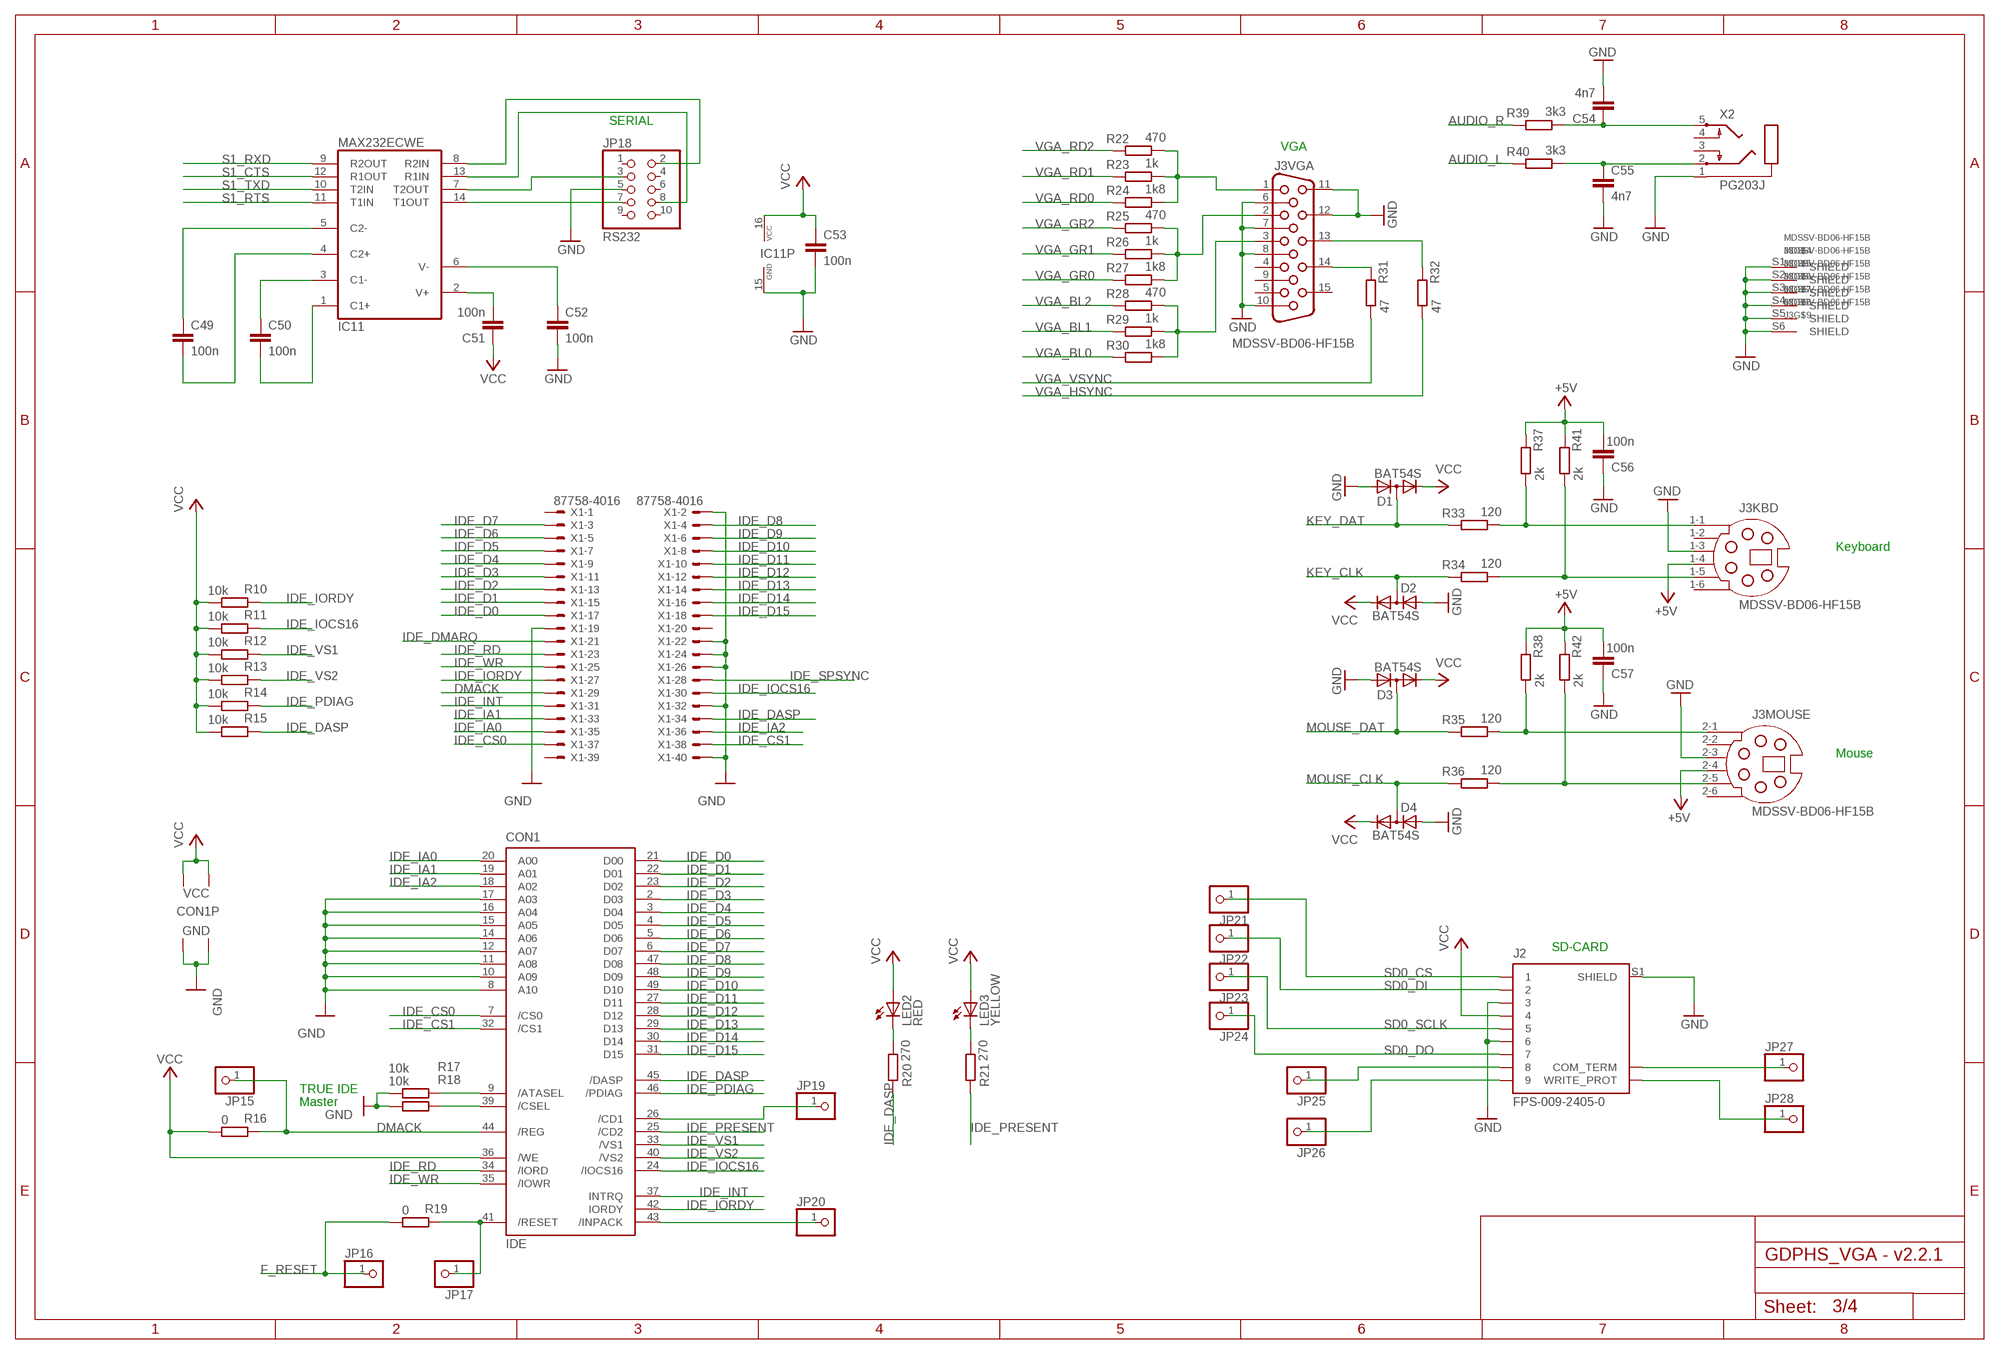
[diagram p3: schematic, sheet 3]

### Parts
C49  100n  C-EUC0805  [C0805]
C50  100n  C-EUC0805  [C0805]
C51  100n  C-EUC0805  [C0805]
C52  100n  C-EUC0805  [C0805]
C53  100n  C-EUC0805  [C0805]
C54  4n7  C-EUC0805  [C0805]
C55  4n7  C-EUC0805  [C0805]
C56  100n  C-EUC0805  [C0805]
C57  100n  C-EUC0805  [C0805]
CON1  IDE  CF-CARD-IDE_MODEYAMAI-CF-CARD-I-II  [CF-050-P2-X03-10-DS-1]
D1  BAT54S  DIODE_2CACA-SOT23  [SOT23]
D2  BAT54S  DIODE_2CACA-SOT23  [SOT23]
D3  BAT54S  DIODE_2CACA-SOT23  [SOT23]
D4  BAT54S  DIODE_2CACA-SOT23  [SOT23]
IC11  MAX232ECWE  [SO16L]
J2  FPS-009-2405-0  [FPS-009-2405-0]
J3  MDSSV-BD06-HF15B  [MDSSV-BD06-HF15-B]
JP15  PINHD-1X1  [1X01]
JP16  PINHD-1X1  [1X01]
JP17  PINHD-1X1  [1X01]
JP18  RS232  PINHD-2X5  [2X05]
JP19  PINHD-1X1  [1X01]
JP20  PINHD-1X1  [1X01]
JP21  PINHD-1X1  [1X01]
JP22  PINHD-1X1  [1X01]
JP23  PINHD-1X1  [1X01]
JP24  PINHD-1X1  [1X01]
JP25  PINHD-1X1  [1X01]
JP26  PINHD-1X1  [1X01]
JP27  PINHD-1X1  [1X01]
JP28  PINHD-1X1  [1X01]
LED2  RED  LEDCHIPLED_0805  [CHIPLED_0805]
LED3  YELLOW  LEDCHIPLED_0805  [CHIPLED_0805]
R10  10k  R-EU_M0805  [M0805]
R11  10k  R-EU_M0805  [M0805]
R12  10k  R-EU_M0805  [M0805]
R13  10k  R-EU_M0805  [M0805]
R14  10k  R-EU_M0805  [M0805]
R15  10k  R-EU_M0805  [M0805]
R16  0  R-EU_M0805  [M0805]
R17  10k  R-EU_M0805  [M0805]
R18  10k  R-EU_M0805  [M0805]
R19  0  R-EU_M0805  [M0805]
R20  270  R-EU_M0805  [M0805]
R21  270  R-EU_M0805  [M0805]
R22  470  R-EU_M0805  [M0805]
R23  1k  R-EU_M0805  [M0805]
R24  1k8  R-EU_M0805  [M0805]
R25  470  R-EU_M0805  [M0805]
R26  1k  R-EU_M0805  [M0805]
R27  1k8  R-EU_M0805  [M0805]
R28  470  R-EU_M0805  [M0805]
R29  1k  R-EU_M0805  [M0805]
R30  1k8  R-EU_M0805  [M0805]
R31  47  R-EU_M0805  [M0805]
R32  47  R-EU_M0805  [M0805]
R33  120  R-EU_M0805  [M0805]
R34  120  R-EU_M0805  [M0805]
R35  120  R-EU_M0805  [M0805]
R36  120  R-EU_M0805  [M0805]
R37  2k  R-EU_M0805  [M0805]
R38  2k  R-EU_M0805  [M0805]
R39  3k3  R-EU_M0805  [M0805]
R40  3k3  R-EU_M0805  [M0805]
R41  2k  R-EU_M0805  [M0805]
R42  2k  R-EU_M0805  [M0805]
X1  87758-4016  [87758-4016]
X2  PG203J  [PG203J]

### Nets
+5V: C56.2 C57.2 J3.1-4 J3.2-4 R37.1 R38.1 R41.1 R42.1 ; also sheet 1,2
AUDIO_L: R40.1 ; also sheet 1
AUDIO_R: R39.1 ; also sheet 1
DMACK: CON1.44(/REG) JP15.1 R16.1 X1.29
F_RESET: JP16.1 R19.2 ; also sheet 1,4
GND: C52.2 C53.2 C54.2 C55.2 C56.1 C57.1 CON1.1(GND1) CON1.8(A10) CON1.10(A09) CON1.11(A08) CON1.12(A07) CON1.14(A06) CON1.15(A05) CON1.16(A04) CON1.17(A03) CON1.50(GND2) D1.1(A) D2.1(A) D3.1(A) D4.1(A) IC11.15(GND) J2.3 J2.6 J2.S1(SHIELD) J3.1-3 J3.2-3 J3.6 J3.7 J3.8 J3.10 J3.11 J3.12 J3.S1(SHIELD) J3.S2(SHIELD) J3.S3(SHIELD) J3.S4(SHIELD) J3.S5(SHIELD) J3.S6(SHIELD) JP18.5 R17.2 R18.2 X1.2 X1.19 X1.22 X1.24 X1.26 X1.32 X1.40 X2.1 ; also sheet 1,2,4
IDE_CS0: CON1.7(/CS0) X1.37 ; also sheet 1
IDE_CS1: CON1.32(/CS1) X1.38 ; also sheet 1
IDE_D0: CON1.21(D00) X1.17 ; also sheet 1
IDE_D1: CON1.22(D01) X1.15 ; also sheet 1
IDE_D2: CON1.23(D02) X1.13 ; also sheet 1
IDE_D3: CON1.2(D03) X1.11 ; also sheet 1
IDE_D4: CON1.3(D04) X1.9 ; also sheet 1
IDE_D5: CON1.4(D05) X1.7 ; also sheet 1
IDE_D6: CON1.5(D06) X1.5 ; also sheet 1
IDE_D7: CON1.6(D07) X1.3 ; also sheet 1
IDE_D8: CON1.47(D08) X1.4 ; also sheet 1
IDE_D9: CON1.48(D09) X1.6 ; also sheet 1
IDE_D10: CON1.49(D10) X1.8 ; also sheet 1
IDE_D11: CON1.27(D11) X1.10 ; also sheet 1
IDE_D12: CON1.28(D12) X1.12 ; also sheet 1
IDE_D13: CON1.29(D13) X1.14 ; also sheet 1
IDE_D14: CON1.30(D14) X1.16 ; also sheet 1
IDE_D15: CON1.31(D15) X1.18 ; also sheet 1
IDE_DASP: CON1.45(/DASP) R15.1 R20.1 X1.34
IDE_DMARQ: X1.21
IDE_IA0: CON1.20(A00) X1.35 ; also sheet 1
IDE_IA1: CON1.19(A01) X1.33 ; also sheet 1
IDE_IA2: CON1.18(A02) X1.36 ; also sheet 1
IDE_INT: CON1.37(INTRQ) X1.31 ; also sheet 1
IDE_IOCS16: CON1.24(/IOCS16) R11.1 X1.30
IDE_IORDY: CON1.42(IORDY) R10.1 X1.27
IDE_PDIAG: CON1.46(/PDIAG) R14.1
IDE_PRESENT: CON1.25(/CD2) R21.1
IDE_RD: CON1.34(/IORD) X1.23 ; also sheet 1
IDE_SPSYNC: X1.28
IDE_VS1: CON1.33(/VS1) R12.1
IDE_VS2: CON1.40(/VS2) R13.1
IDE_WR: CON1.35(/IOWR) X1.25 ; also sheet 1
KEY_CLK: D2.3(AC) R34.1 ; also sheet 1
KEY_DAT: D1.3(AC) R33.1 ; also sheet 1
MOUSE_CLK: D4.3(AC) R36.1 ; also sheet 1
MOUSE_DAT: D3.3(AC) R35.1 ; also sheet 1
N$1: C50.2 IC11.1(C1+)
N$2: LED2.C R20.2
N$3: C50.1 IC11.3(C1-)
N$4: C49.2 IC11.4(C2+)
N$6: C49.1 IC11.5(C2-)
N$7: C52.1 IC11.6(V-)
N$8: C51.2 IC11.2(V+)
N$9: LED3.C R21.2
N$10: IC11.8(R2IN) JP18.2
N$11: IC11.13(R1IN) JP18.8
N$12: IC11.7(T2OUT) JP18.3
N$13: J3.1 R22.2 R23.2 R24.2
N$14: J3.2 R25.2 R26.2 R27.2
N$17: J3.3 R28.2 R29.2 R30.2
N$18: J3.13 R32.1
N$19: J3.14 R31.1
N$20: J3.1-1 R33.2 R37.2
N$21: J3.1-5 R34.2 R41.2
N$22: J3.2-1 R35.2 R38.2
N$23: J3.2-5 R36.2 R42.2
N$27: CON1.39(/CSEL) R18.1
N$28: CON1.9(/ATASEL) R17.1
N$29: C54.1 R39.2 X2.5
N$30: C55.1 R40.2 X2.2
N$35: IC11.14(T1OUT) JP18.7
N$38: CON1.41(/RESET) JP17.1 R19.1
N$39: CON1.43(/INPACK) JP20.1
N$43: CON1.26(/CD1) JP19.1
N$45: J2.8 JP25.1
N$46: J2.9 JP26.1
N$47: J2.CD(COM_TERM) JP27.1
N$48: J2.WP(WRITE_PROT) JP28.1
S1_CTS: IC11.12(R1OUT) ; also sheet 1
S1_RTS: IC11.11(T1IN) ; also sheet 1
S1_RXD: IC11.9(R2OUT) ; also sheet 1
S1_TXD: IC11.10(T2IN) ; also sheet 1
SD0_CS: J2.1 JP21.1 ; also sheet 1
SD0_DI: J2.2 JP22.1 ; also sheet 1,4
SD0_DO: J2.7 JP24.1 ; also sheet 1,4
SD0_SCLK: J2.5 JP23.1 ; also sheet 1,4
VCC: C51.1 C53.1 CON1.13(VCC2) CON1.36(/WE) CON1.38(VCC1) D1.2(C) D2.2(C) D3.2(C) D4.2(C) IC11.16(VCC) J2.4 LED2.A LED3.A R10.2 R11.2 R12.2 R13.2 R14.2 R15.2 R16.2 ; also sheet 1,2,4
VGA_BL0: R30.1 ; also sheet 1
VGA_BL1: R29.1 ; also sheet 1
VGA_BL2: R28.1 ; also sheet 1
VGA_GR0: R27.1 ; also sheet 1
VGA_GR1: R26.1 ; also sheet 1
VGA_GR2: R25.1 ; also sheet 1
VGA_HSYNC: R32.2 ; also sheet 1
VGA_RD0: R24.1 ; also sheet 1
VGA_RD1: R23.1 ; also sheet 1
VGA_RD2: R22.1 ; also sheet 1
VGA_VSYNC: R31.2 ; also sheet 1
Unconnected: J3.1-2 J3.1-6 J3.2-2 J3.2-6 J3.4 J3.5 J3.9 J3.15 JP18.1 JP18.4 JP18.6 JP18.9 JP18.10 X1.1 X1.20 X1.39 X2.3 X2.4

### Notes on the sheet
- SERIAL
- VGA
- Keyboard
- Mouse
- SD-CARD
- TRUE IDE
- Master

## Sheet 4 of 4
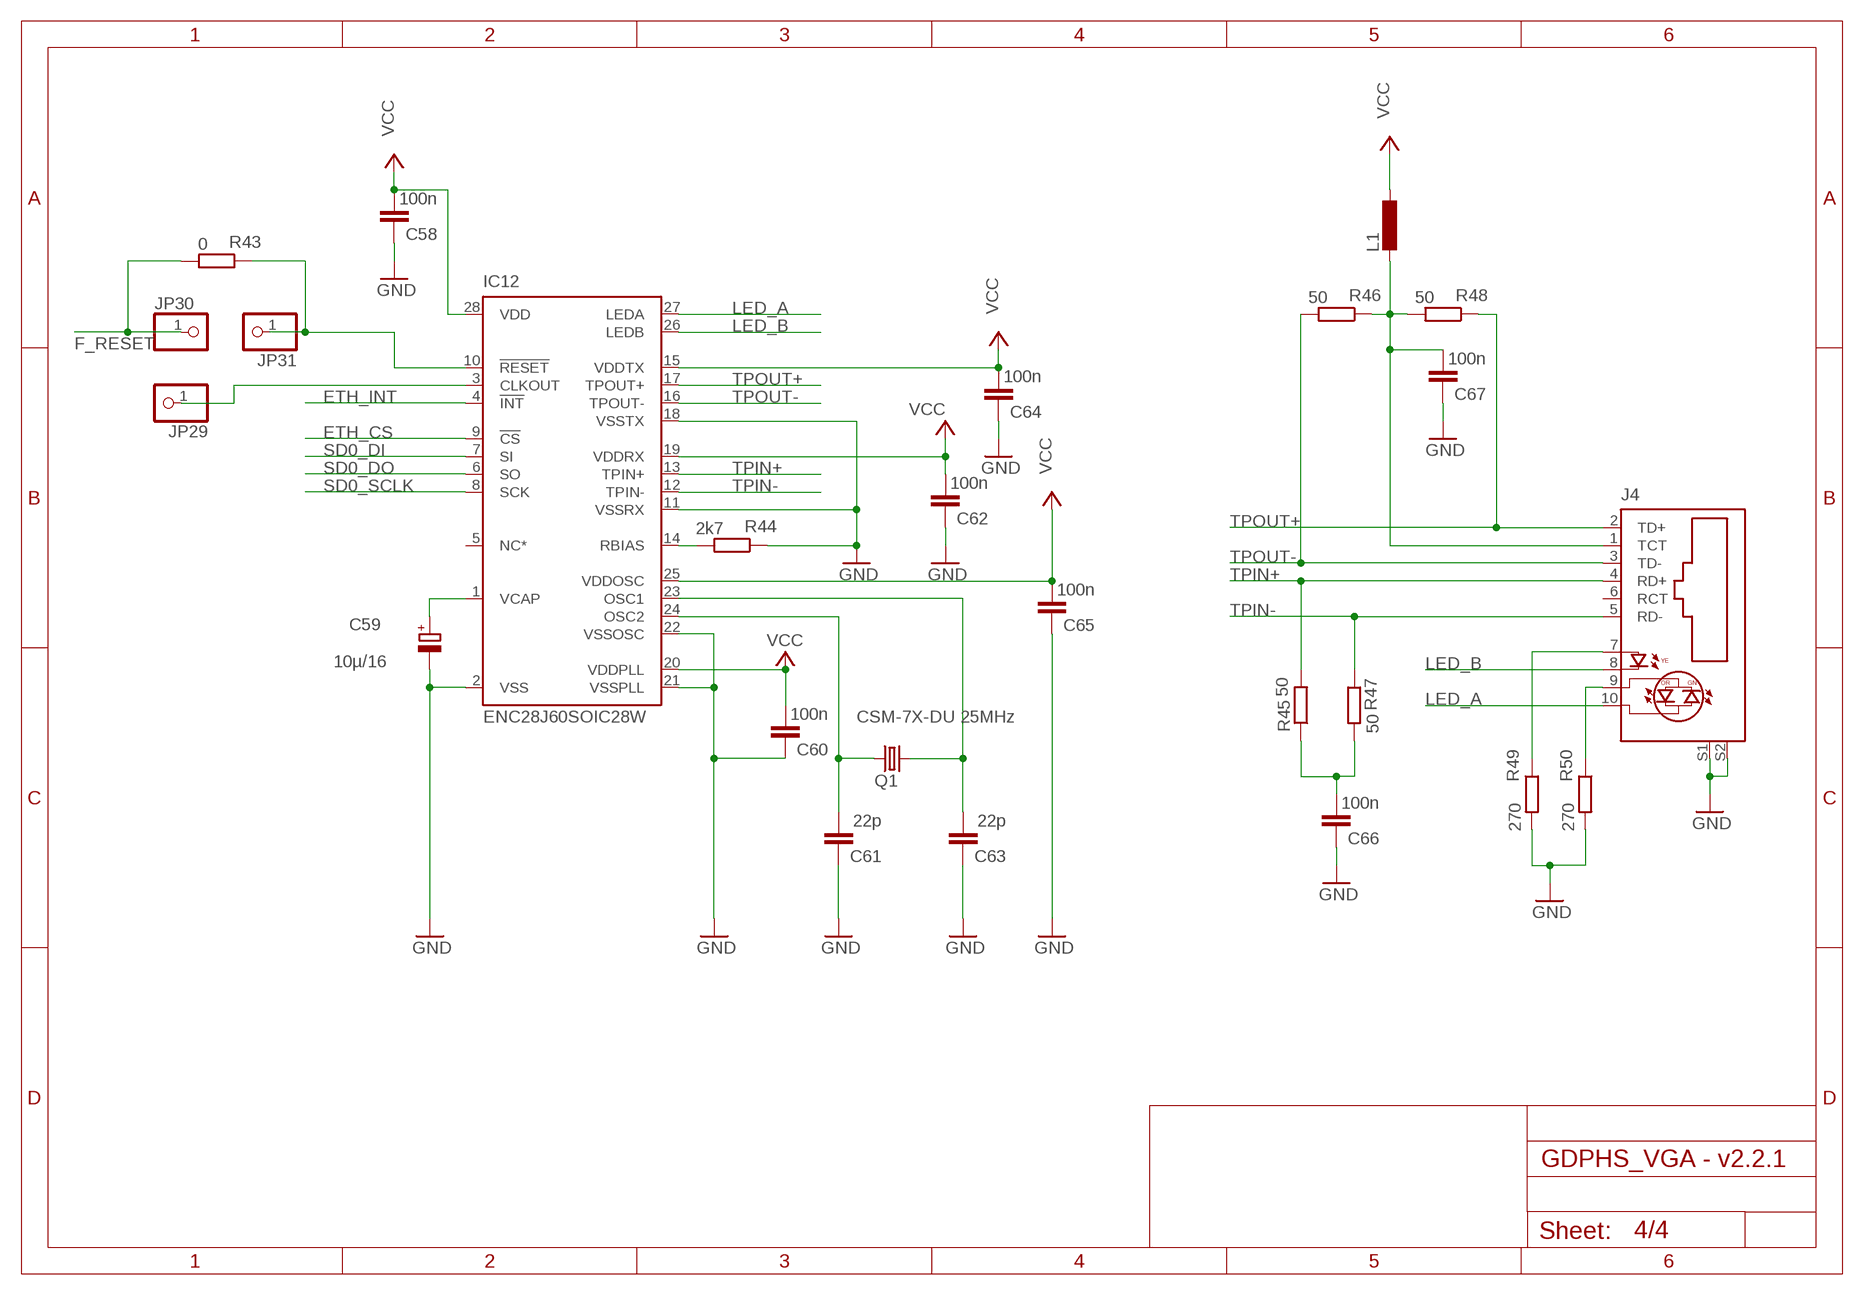
[diagram p4: schematic, sheet 4]

### Parts
C58  100n  C-EUC0805  [C0805]
C59  10µ/16  CPOL-EUSMCC  [SMC_C]
C60  100n  C-EUC0805  [C0805]
C61  22p  C-EUC0805  [C0805]
C62  100n  C-EUC0805  [C0805]
C63  22p  C-EUC0805  [C0805]
C64  100n  C-EUC0805  [C0805]
C65  100n  C-EUC0805  [C0805]
C66  100n  C-EUC0805  [C0805]
C67  100n  C-EUC0805  [C0805]
IC12  ENC28J60SOIC28W  [SO28W]
J4  08B0-1X1T-36-F08B0-1X1T-36-F  [08B0-1X1T-36-F]
JP29  PINHD-1X1  [1X01]
JP30  PINHD-1X1  [1X01]
JP31  PINHD-1X1  [1X01]
L1  L-EUL1206  [L1206]
Q1  CSM-7X-DU 25MHz  CSM-7X-DU  [CSM-7X-DU]
R43  0  R-EU_M0805  [M0805]
R44  2k7  R-EU_M0805  [M0805]
R45  50  R-EU_M0805  [M0805]
R46  50  R-EU_M0805  [M0805]
R47  50  R-EU_M0805  [M0805]
R48  50  R-EU_M0805  [M0805]
R49  270  R-EU_M0805  [M0805]
R50  270  R-EU_M0805  [M0805]

### Nets
ETH_CS: IC12.9(!CS) ; also sheet 1
ETH_INT: IC12.4(!INT) ; also sheet 1
F_RESET: JP30.1 R43.2 ; also sheet 1,3
GND: C58.1 C59.- C60.1 C61.1 C62.1 C63.1 C64.1 C65.1 C66.1 C67.1 IC12.2(VSS) IC12.11(VSSRX) IC12.18(VSSTX) IC12.21(VSSPLL) IC12.22(VSSOSC) J4.S1 J4.S2 R44.1 R49.2 R50.2 ; also sheet 1,2,3
LED_A: IC12.27(LEDA) J4.10(C1)
LED_B: IC12.26(LEDB) J4.8(C)
N$16: J4.9(A1) R50.1
N$24: J4.7(A) R49.1
N$40: IC12.10(!RESET) JP31.1 R43.1
N$44: IC12.3(CLKOUT) JP29.1
N$50: C63.2 IC12.23(OSC1) Q1.2
N$51: C61.2 IC12.24(OSC2) Q1.1
N$52: C59.+ IC12.1(VCAP)
N$53: IC12.14(RBIAS) R44.2
N$54: C66.2 R45.1 R47.2
N$55: C67.2 J4.1(TCT) L1.2 R46.1 R48.2
SD0_DI: IC12.7(SI) ; also sheet 1,3
SD0_DO: IC12.6(SO) ; also sheet 1,3
SD0_SCLK: IC12.8(SCK) ; also sheet 1,3
TPIN+: IC12.13(TPIN+) J4.4(RD+) R45.2
TPIN-: IC12.12(TPIN-) J4.5(RD-) R47.1
TPOUT+: IC12.17(TPOUT+) J4.2(TD+) R48.1
TPOUT-: IC12.16(TPOUT-) J4.3(TD-) R46.2
VCC: C58.2 C60.2 C62.2 C64.2 C65.2 IC12.15(VDDTX) IC12.19(VDDRX) IC12.20(VDDPLL) IC12.25(VDDOSC) IC12.28(VDD) L1.1 ; also sheet 1,2,3
Unconnected: IC12.5(NC*) J4.6(RCT)

## Power pins joined to a net without a drawn wire
GND: IC1.10(GND) IC2.10(GND) IC3.10(GND) IC4.10(GND) IC5.10(GND)
VCC: IC1.20(VCC) IC2.20(VCC) IC3.20(VCC) IC4.20(VCC) IC5.20(VCC)

## Library data of the parts
C1-C3 C5 C6 C8 C10 C13 C14 C16 C17 C21 C23 C25-C29 C31-C58 C60-C67 = rcl:C-EU: CAPACITOR, European symbol; OC_REICHELT: X7R-G0805 [100N]
C4 C7 C9 C11 C12 C15 C18-C20 C22 C24 C30 C59 = rcl:CPOL-EU: POLARIZED CAPACITOR, European symbol; OC_REICHELT: SMD TAN [10/16]
CON1 = con-hirose:CF-CARD-IDE_MODE: Compact Flash Adapter Type I or II without Eject Button Source: con-hirose.lbr from Bob Starr <rtzaudio@mindspring.com>; MF: Yamaichi; MPN: CF-050P2-103-10-DS1; OC_REICHELT: CONNECTOR CF 02
D1-D4 = diode:DIODE_2CACA-: 2 Diodes - Cathode-Anode|Cathode-Anode; OC_REICHELT: BAT 54S SMD
IC1-IC5 = 74xx-eu:74*245: Octal BUS TRANSCEIVER, 3-state; MF: Texas Instruments; MPN: SN74LVC245ADWR; OC_DIGIKEY: 296-1232-1-ND
IC6 = Xilinx:XC9536
IC7 = GDPHS_VGA - v2.1:LFXP2C_XX208-2; MF: Lattice; MPN: LFXP2-8E-5QN208C; OC_DIGIKEY: 220-1253-ND
IC8 IC9 = GDPHS_VGA - v2.1:IS64WV51216; MF: Cypress; MPN: CY7C1051DV33-10ZSXI; OC_DIGIKEY: 428-3241-ND
IC10 = linear-technology:LT1086; MF: Linear Technology; MPN: LT1086CM-3.3#PBF; OC_DIGIKEY: LT1086CM-3.3#PBF-ND
IC11 = maxim:MAX232ECWE: RS232 TRANSCEIVER; MF: MAXIM; MPN: MAX232ECWE+; OC_FARNELL: 9724435; OC_NEWARK: 67K4440
IC12 = microchip:ENC28J60: Stand-Alone Ethernet Controller with SPI Interface Source: http://ww1.microchip.com/downloads/en/DeviceDoc/39662c.pdf; MF: MICROCHIP; OC_DIGIKEY: ENC28J60-I/SO-ND; OC_REICHELT: ENC 28J60-I/SO
IC13 = GDPHS_VGA - v2.1:MCP170X; OC_DIGIKEY: MCP1703T-1202E/MBCT-ND; OC_REICHELT: MCP 1703-1202MB
J1 = 19inch:VG96: PCB EUROCARD, 96-pin type C/ABC, 2.54 mm; OC_REICHELT: ML-C 96W
J2 = dummy:FPS-009-2405-0: YAMAI SD Card - FPS Series 009-2405-0; MF: Yamaichi; MPN: FPS-009-2405-0; OC_REICHELT: CONNECTOR SD 22
J3 = dummy:MDSSV-BD06-HF15; MF: Norcomp Inc.; MPN: 999-H15-PS2L571; OC_DIGIKEY: 999-H15FA-ND
J4 = con-stewart:08B0-1X1T-36-F; MF: Bel Stewart; MPN: 08B0-1X1T-36-F; OC_DIGIKEY: 507-1446-ND
JP1-JP17 JP19-JP31 = pinhead:PINHD-1X1: PIN HEADER
JP18 = pinhead:PINHD-2X5: PIN HEADER
L1 = rcl:L-EU: INDUCTOR, European symbol; MF: Steward; MPN: MI1210K600R-10; OC_DIGIKEY: 240-2416-1-ND; OC_REICHELT: BLM31PG 500
LED1-LED3 = led:LED: LED OSRAM: - CHIPLED LG R971, LG N971, LY N971, LG Q971, LY Q971, LO R971, LY R971 LH N974, LH R974 LS Q976, LO Q976, LY Q976 LO Q996 - Hyper CHIPLED LW Q18S LB Q993, LB Q99A, LB R99A - SideLED LS A670, LO A670, LY A670, LG A670, LP A670 LB A673, LV A673, LT A673, LW A673 LH A674 LY A675 LS A676, LA A676, LO A676, LY A676, LW A676 LS A679, LY A679, LG A679 - Hyper Micro SIDELED® LS Y876, LA Y876, LO Y876, LY Y876 LT Y87S - SmartLED LW L88C, LW L88S LB L89C, LB L89S, LG L890 LS L89K, LO L89K, LY L89K LS L896, LA L896, LO L896, LY L896 - TOPLED LS T670, LO T670, LY T670, LG T670, LP T670 LSG T670, LSP T670, LSY T670, LOP T670, LYG T670 LG T671, LOG T671, LSG T671 LB T673, LV T673, LT T673, LW T673 LH T674 LS T676, LA T676, LO T676, LY T676, LB T676, LH T676, LSB T676, LW T676 LB T67C, LV T67C, LT T67C, LS T67K, LO T67K, LY T67K, LW E67C LS E67B, LA E67B, LO E67B, LY E67B, LB E67C, LV E67C, LT E67C LW T67C LS T679, LY T679, LG T679 LS T770, LO T770, LY T770, LG T770, LP T770 LB T773, LV T773, LT T773, LW T773 LH T774 LS E675, LA E675, LY E675, LS T675 LS T776, LA T776, LO T776, LY T776, LB T776 LHGB T686 LT T68C, LB T68C - Hyper Mini TOPLED® LB M676 - Mini TOPLED Santana® LG M470 LS M47K, LO M47K, LY M47K Source: http://www.osram.convergy.de LUXEON: - LUMILED® LXK2-PW12-R00, LXK2-PW12-S00, LXK2-PW14-U00, LXK2-PW14-V00 LXK2-PM12-R00, LXK2-PM12-S00, LXK2-PM14-U00 LXK2-PE12-Q00, LXK2-PE12-R00, LXK2-PE12-S00, LXK2-PE14-T00, LXK2-PE14-U00 LXK2-PB12-K00, LXK2-PB12-L00, LXK2-PB12-M00, LXK2-PB14-N00, LXK2-PB14-P00, LXK2-PB14-Q00 LXK2-PR12-L00, LXK2-PR12-M00, LXK2-PR14-Q00, LXK2-PR14-R00 LXK2-PD12-Q00, LXK2-PD12-R00, LXK2-PD12-S00 LXK2-PH12-R00, LXK2-PH12-S00 LXK2-PL12-P00, LXK2-PL12-Q00, LXK2-PL12-R00 Source: www.luxeon.com KINGBRIGHT: KA-3528ASYC Source: www.kingbright.com; OC_REICHELT: SMD-LED 1206 [GN|RT|GE]
Q1 = crystal:CSM-7X-DU: SMD CRYSTAL Source: www.ecsxtal.com .. Crystal 3.6864MHz CSM_7X_DU.PDF; MF: CITIZEN; MPN: CS10-25.000MABJTR; OC_DIGIKEY: 300-8105-1-ND; OC_FARNELL: unknown; OC_NEWARK: unknown
QG1 = dummy:CRYSTAL_RESONATOR: CRYSTAL RESONATOR; MF: IQD FREQUENCY PRODUCTS; MPN: LF SPXO018042 - QUARZ, 40MHZ, 15PF, SMD; OC_FARNELL: 9713565
R1-R50 = rcl:R-EU_: RESISTOR, European symbol; OC_REICHELT: SMD-0805 [10,0K]
SV1 = con-lstb:MA06-1: PIN HEADER; OC_FARNELL: unknown; OC_NEWARK: unknown
SV2 = con-lstb:MA05-2: PIN HEADER; OC_FARNELL: unknown; OC_NEWARK: unknown
X1 = con-molex:87758-4016: 40 Pin - 2mm Dual Row Single Wafer, Vertical T/H HDR Source: http://www.molex.com/pdm_docs/sd/877580616_sd.pdf; MPN: 87758-4016; OC_FARNELL: unknown; OC_NEWARK: 25M5691
X2 = con-hirschmann:PG203J: MIC/HEADPHONE JACK KS-S stereo microphone/headphone jack PG203JN (Schukat); OC_REICHELT: EBS 35 BL